# Altium schematic sheet mcu.SchDoc
size A4
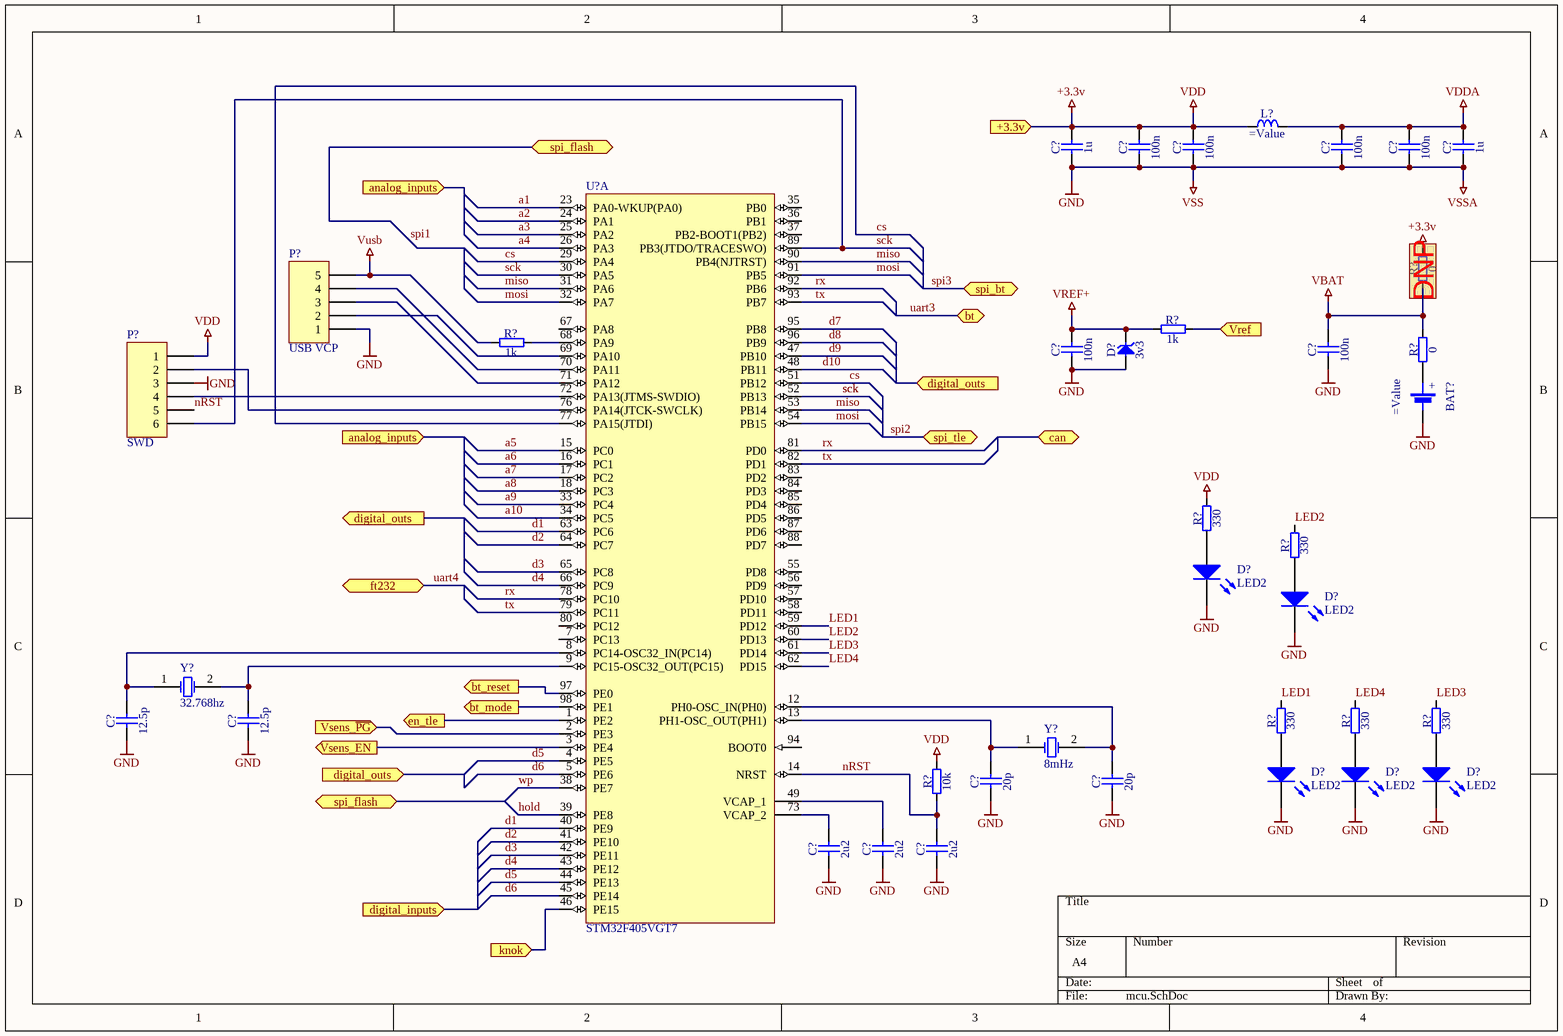
[diagram p0: mcu.SchDoc]

## Parts
(Parts that share a designator on the sheet are numbered #1, #2 ... from top to bottom, then left to right.)
BAT?  (no value)
C?#1  1u
C?#2  100n
C?#3  100n
C?#4  100n
C?#5  100n
C?#6  1u
C?#7  100n
C?#8  100n
C?#9  12.5p
C?#10  12.5p
C?#11  20p
C?#12  20p
C?#13  2u2
C?#14  2u2
C?#15  2u2
D?#1  3v3
D?#2  LED2  [3.2X1.6X1.1]
D?#3  LED2  [3.2X1.6X1.1]
D?#4  LED2  [3.2X1.6X1.1]
D?#5  LED2  [3.2X1.6X1.1]
D?#6  LED2  [3.2X1.6X1.1]
L?  (no value)
P?#1  SWD  [HDR1X6]
P?#2  USB VCP  [HDR1X5]
R?#1  0
R?#2  1k
R?#3  1k
R?#4  0
R?#5  330
R?#6  330
R?#7  330
R?#8  330
R?#9  330
R?#10  10k
U?  STM32F405VGT7  [STM-LQFP100_L]  (part A of 2)
Y?#1  32.768hz  [R38]
Y?#2  8mHz  [R38]

## Ports
+3.3v (in), analog_inputs (in), bt (bidir), bt_mode (out), bt_reset (out), can (bidir), digital_inputs (in), digital_outs (in), digital_outs (out), en_tle (out), ft232 (bidir), knok (in), spi_bt (bidir), spi_flash (bidir), spi_tle (bidir), Vref (in), Vsens_EN (out), Vsens_~{PG} (in)

## Nets
+3.3v: C?#1.2 C?#2.2 C?#3.2 L?.1 P?#1.1 R?#1.2 R?#5.2 R?#10.2 ; port +3.3v  [also labelled VDD]
GND: BAT?.2(MINUS) C?#1.1 C?#2.1 C?#3.1 C?#4.1 C?#5.1 C?#6.1 C?#7.1 C?#8.1 C?#9.1 C?#10.1 C?#11.1 C?#12.1 C?#13.1 C?#14.1 C?#15.1 D?#1.2(A) D?#2.2(K) D?#3.2(K) D?#4.2(K) D?#5.2(K) D?#6.2(K) P?#1.3 P?#2.1  [also labelled VSS, VSSA]
VBAT: C?#8.2 R?#1.1 R?#4.2
VDDA: C?#4.2 C?#5.2 C?#6.2 L?.2
VREF+: C?#7.2 D?#1.1(C) R?#2.1
Vusb: P?#2.5 R?#3.1
a1: U?.23(PA0-WKUP(PA0))
a2: U?.24(PA1)
a3: U?.25(PA2)
a4: U?.26(PA3)
a5: U?.15(PC0)
a6: U?.16(PC1)
a7: U?.17(PC2)
a8: U?.18(PC3)
a9: U?.33(PC4)
a10: U?.34(PC5)
bt_mode: U?.98(PE1) ; port bt_mode
bt_reset: U?.97(PE0) ; port bt_reset
cs: U?.29(PA4) U?.51(PB12) U?.77(PA15(JTDI))
d1: U?.40(PE9) U?.63(PC6)
d2: U?.41(PE10) U?.64(PC7)
d3: U?.42(PE11) U?.65(PC8)
d4: U?.43(PE12) U?.66(PC9)
d5: U?.4(PE5) U?.44(PE13)
d6: U?.5(PE6) U?.45(PE14)
d7: U?.95(PB8)
d8: U?.96(PB9)
d9: U?.47(PB10)
d10: U?.48(PB11)
en_tle: U?.1(PE2) ; port en_tle
hold: U?.39(PE8)
knok: U?.46(PE15) ; port knok
LED1: R?#7.2 U?.59(PD12)
LED2: R?#6.2 U?.60(PD13)
LED3: R?#9.2 U?.61(PD14)
LED4: R?#8.2 U?.62(PD15)
miso: U?.31(PA6) U?.53(PB14) U?.90(PB4(NJTRST))
mosi: U?.32(PA7) U?.54(PB15) U?.91(PB5)
nRST: C?#15.2 P?#1.5 R?#10.1 U?.14(NRST)
rx: U?.78(PC10) U?.81(PD0) U?.92(PB6)
sck: P?#1.6 U?.30(PA5) U?.52(PB13) U?.89(PB3(JTDO/TRACESWO))
tx: U?.79(PC11) U?.82(PD1) U?.93(PB7)
Vref: R?#2.2 ; port Vref
Vsens_EN: U?.3(PE4) ; port Vsens_EN
Vsens_~{PG}: U?.2(PE3) ; port Vsens_~{PG}
wp: U?.38(PE7)
NetBAT?_1: BAT?.1(PLUS) R?#4.1
NetC?#9_2: C?#9.2 U?.8(PC14-OSC32_IN(PC14)) Y?#1.1(OSC1)
NetC?#10_2: C?#10.2 U?.9(PC15-OSC32_OUT(PC15)) Y?#1.2(OSC2)
NetC?#11_2: C?#11.2 U?.13(PH1-OSC_OUT(PH1)) Y?#2.1(OSC1)
NetC?#12_2: C?#12.2 U?.12(PH0-OSC_IN(PH0)) Y?#2.2(OSC2)
NetC?#13_2: C?#13.2 U?.73(VCAP_2)
NetC?#14_2: C?#14.2 U?.49(VCAP_1)
NetD?#2_1: D?#2.1(A) R?#5.1
NetD?#3_1: D?#3.1(A) R?#6.1
NetD?#4_1: D?#4.1(A) R?#7.1
NetD?#5_1: D?#5.1(A) R?#8.1
NetD?#6_1: D?#6.1(A) R?#9.1
NetP?#1_2: P?#1.2 U?.76(PA14(JTCK-SWCLK))
NetP?#1_4: P?#1.4 U?.72(PA13(JTMS-SWDIO))
NetP?#2_2: P?#2.2 U?.69(PA10)
NetP?#2_3: P?#2.3 U?.71(PA12)
NetP?#2_4: P?#2.4 U?.70(PA11)
NetR?#3_2: R?#3.2 U?.68(PA9)

Not connected (* = marked no-connect by the designer): U? 7(PC13) 35(PB0) 36(PB1) 37(PB2-BOOT1(PB2)) 55(PD8) 56(PD9) 57(PD10) 58(PD11) 67(PA8) 80(PC12) 83(PD2) 84(PD3) 85(PD4) 86(PD5) 87(PD6) 88(PD7) 94(BOOT0)

## Buses and harness runs
bus spi1 = port spi_flash
bus spi2 = port spi_tle
bus spi3 = port spi_bt
bus uart3 = port bt
bus uart4 = port ft232

## Notes on the sheet
- (near R?#1) DNP
- (in symbol Battery 2 Pin) +

## Library data of the parts
BAT? = Battery 2 Pin
C?#1-C?#15 = Capacitor - non polarized: Non-polarised capacitor
  C?#1 C?#6: Value: 1u
  C?#2-C?#5 C?#7 C?#8: Value: 100n
  C?#9 C?#10: Value: 12.5p
  C?#11 C?#12: Value: 20p
  C?#13-C?#15: Value: 2u2
D?#1 = Diode TVS Uni-Directional: Transient Voltage Suppressor Diode (Uni-Directional); Device: 3v3
D?#2-D?#6 = LED2: Typical RED, GREEN, YELLOW, AMBER GaAs LED; Published: 8-Jun-2000; LatestRevisionDate: 17-Jul-2002; LatestRevisionNote: Re-released for DXP Platform.; PackageVersion: Feb-2002; PackageReference: 3.2X1.6X1.1; Publisher: Altium Limited; PackageDescription: SM LED; 2 Flat Leads
L? = Inductor
P?#1 = Header 6: Header, 6-Pin; LatestRevisionDate: 17-Jul-2002; LatestRevisionNote: Re-released for DXP Platform.; Publisher: Altium Limited
P?#2 = Header 5: Header, 5-Pin; LatestRevisionDate: 17-Jul-2002; LatestRevisionNote: Re-released for DXP Platform.; Publisher: Altium Limited
R?#1-R?#10 = Resistor
  R?#1 R?#4: Value: 0
  R?#2 R?#3: Value: 1k
  R?#5-R?#9: Value: 330
  R?#10: Value: 10k
U? = STM32F405VGT7: ARM Cortex-M4 32-bit MCU+FPU, 210 DMIPS, 1024 kB Flash, 192 kB Internal RAM, 82 I/Os, 100-pin LQFP, -40 to 105 degC, Tray; Manufacturer: STMicroelectronics; Operating Frequency(F) (Processor speed) (MHz): 168; Internal RAM Size (kB): 192; Supply Voltage(Vcc) max (V): 3.6; I/Os (High Current): 82; Supply Voltage(Vcc) min (V): 1.8; FLASH Size (Prog) (kB): 1024; D/A Converter: 2x12-bit; ComponentLink1Description: Manufacturer URL; PartNumber: STM32F405VGT7; Core: ARM Cortex-M4; ComponentLink2Description: Datasheet; DatasheetVersion: Rev. 4; ComponentLink3URL: http://www.st.com/st-web-ui/static/active/en/resource/technical/document/data_brief/DM00071938.pdf; ComponentLink1URL: http://www.st.com/web/en/home.html; Packing: Tray; ComponentLink2URL: http://www.st.com/st-web-ui/static/active/en/resource/technical/document/datasheet/DM00037051.pdf; PackageReference: LQFP100; ComponentLink3Description: Package Specification; PackageVersion: Rev. 1, 06/2013; Mounting Technology: Surface Mount; PackageDescription: 100-Pin Low Profile Quad Flat Package, 14 x 14 mm Body, 0.5 mm Pitch
Y?#1 Y?#2 = XTAL: Crystal Oscillator; Published: 8-Jun-2000; LatestRevisionDate: 17-Jul-2002; LatestRevisionNote: Re-released for DXP Platform.; PackageReference: R38; Publisher: Altium Limited; PackageDescription: Crystal, Thru-Hole; 2 Leads; Body 3.1 x 8.2 mm (Dia.xH)
  Y?#1: Value: 32.768hz
  Y?#2: Value: 8mHz